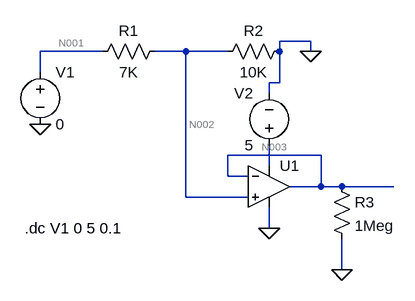
[diagram p0: schematic VoltageDividerCircuit.asc]
VoltageDividerCircuit.asc, the LTspice schematic file:
Version 4.1
SHEET 1 880 680
WIRE 496 64 448 64
WIRE 176 80 80 80
WIRE 304 80 256 80
WIRE 368 80 304 80
WIRE 448 80 448 64
WIRE 496 80 496 64
WIRE 80 112 80 80
WIRE 448 128 448 80
WIRE 448 128 432 128
WIRE 432 144 432 128
WIRE 512 240 368 240
WIRE 432 256 432 224
WIRE 368 272 368 240
WIRE 400 272 368 272
WIRE 512 288 512 240
WIRE 512 288 464 288
WIRE 544 288 512 288
WIRE 624 288 544 288
WIRE 304 304 304 80
WIRE 400 304 304 304
WIRE 432 352 432 320
WIRE 544 416 544 368
FLAG 80 192 0
FLAG 496 80 0
FLAG 432 352 0
FLAG 544 416 0
SYMBOL voltage 80 96 R0
WINDOW 123 0 0 Left 0
WINDOW 39 0 0 Left 0
SYMATTR InstName V1
SYMATTR Value 0
SYMBOL res 272 64 R90
WINDOW 0 0 56 VBottom 2
WINDOW 3 32 56 VTop 2
SYMATTR InstName R1
SYMATTR Value 7K
SYMATTR SpiceLine tol=1 pwr=0.1
SYMBOL res 464 64 R90
WINDOW 0 0 56 VBottom 2
WINDOW 3 32 56 VTop 2
SYMATTR InstName R2
SYMATTR Value 10K
SYMATTR SpiceLine tol=1 pwr=0.1
SYMBOL voltage 432 240 R180
WINDOW 0 24 96 Left 2
WINDOW 3 24 16 Left 2
WINDOW 123 0 0 Left 0
WINDOW 39 0 0 Left 0
SYMATTR InstName V2
SYMATTR Value 5
SYMBOL OpAmps\\UniversalOpAmp2 432 288 R0
SYMATTR InstName U1
SYMBOL res 528 272 R0
SYMATTR InstName R3
SYMATTR Value 1Meg
SYMATTR SpiceLine tol=1 pwr=0.1
TEXT 56 352 Left 2 !.dc V1 0 5 0.1

The netlist it stands for:
* VoltageDividerCircuit.asc
V1 N001 0 0
R1 N002 N001 7K tol=1 pwr=0.1
R2 0 N002 10K tol=1 pwr=0.1
V2 N004 0 5
X§U1 N002 N003 N004 0 N003 level2 Avol=1Meg GBW=10Meg Slew=10Meg Ilimit=25m Rail=0 Vos=0 En=0 Enk=0 In=0 Ink=0 Rin=500Meg  ; pins In+ In- V+ V- OUT
R3 N003 0 1Meg tol=1 pwr=0.1
.dc V1 0 5 0.1
.lib UniversalOpAmp2.lib
.backanno
.end

* Results of the author's LTspice run, read from the files saved beside the schematic
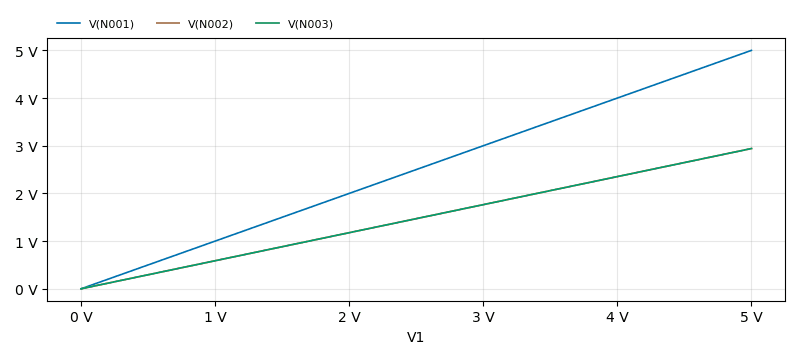
[diagram p1: DC transfer characteristic of VoltageDividerCircuit.asc, plotted from the saved traces]
* DC transfer characteristic, 1 run:
*   V(N001): 0 V at V1=0 V, 5 V at V1=5 V, min 0 V, max 5 V
*   V(N002): 20.59 µV at V1=0 V, 2.941 V at V1=5 V, min 20.59 µV, max 2.941 V
*   V(N003): 102.6 µV at V1=0 V, 2.941 V at V1=5 V, min 102.6 µV, max 2.941 V